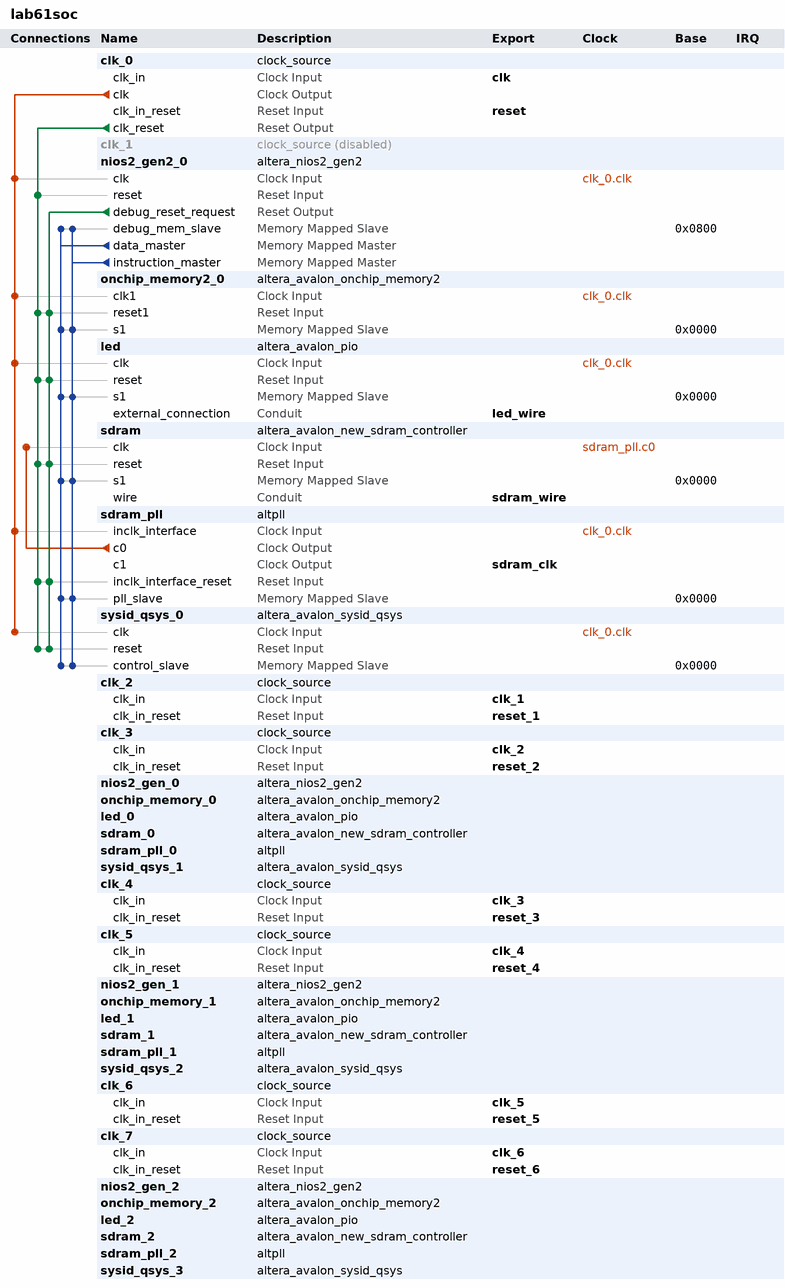
[diagram p0: system contents]
# Platform Designer (Qsys) system lab61soc, MAX 10 10M50DAF484C7G
# Parameters at their usual value, and those the tool derives, are not listed.
package require -exact qsys 18.1
create_system lab61soc
set_project_property DEVICE_FAMILY {MAX 10}
set_project_property DEVICE 10M50DAF484C7G

add_instance clk_0 clock_source 18.1
set_instance_parameter_value clk_0 clockFrequency 50000000

add_instance clk_1 clock_source 18.1
set_instance_property clk_1 ENABLED false
set_instance_parameter_value clk_1 clockFrequency 50000000

add_instance nios2_gen2_0 altera_nios2_gen2 18.1
set_instance_parameter_value nios2_gen2_0 dcache_size 2048
set_instance_parameter_value nios2_gen2_0 exceptionSlave None
set_instance_parameter_value nios2_gen2_0 icache_size 4096
set_instance_parameter_value nios2_gen2_0 impl Tiny
set_instance_parameter_value nios2_gen2_0 resetSlave None

add_instance onchip_memory2_0 altera_avalon_onchip_memory2 18.1
set_instance_parameter_value onchip_memory2_0 dataWidth 32
set_instance_parameter_value onchip_memory2_0 dualPort false
set_instance_parameter_value onchip_memory2_0 initMemContent true
set_instance_parameter_value onchip_memory2_0 initializationFileName onchip_mem.hex
set_instance_parameter_value onchip_memory2_0 memorySize 16

add_instance led altera_avalon_pio 18.1
set_instance_parameter_value led direction Output
set_instance_parameter_value led width 8

add_instance sdram altera_avalon_new_sdram_controller 18.1
set_instance_parameter_value sdram TAC 5.4
set_instance_parameter_value sdram TRCD 20.0
set_instance_parameter_value sdram TRP 20.0
set_instance_parameter_value sdram casLatency 3
set_instance_parameter_value sdram columnWidth 10
set_instance_parameter_value sdram dataWidth 16
set_instance_parameter_value sdram generateSimulationModel false
set_instance_parameter_value sdram model single_Micron_MT48LC4M32B2_7_chip
set_instance_parameter_value sdram numberOfBanks 4
set_instance_parameter_value sdram numberOfChipSelects 1
set_instance_parameter_value sdram powerUpDelay 100.0
set_instance_parameter_value sdram refreshPeriod 15.625
set_instance_parameter_value sdram rowWidth 13

add_instance sdram_pll altpll 18.1
set_instance_parameter_value sdram_pll CLK0_DIVIDE_BY 1
set_instance_parameter_value sdram_pll CLK0_MULTIPLY_BY 1
set_instance_parameter_value sdram_pll CLK1_DIVIDE_BY 1
set_instance_parameter_value sdram_pll CLK1_DUTY_CYCLE 50
set_instance_parameter_value sdram_pll CLK1_MULTIPLY_BY 1
set_instance_parameter_value sdram_pll CLK1_PHASE_SHIFT -1000
set_instance_parameter_value sdram_pll INCLK0_INPUT_FREQUENCY 20000
set_instance_parameter_value sdram_pll PORT_ARESET PORT_UNUSED
set_instance_parameter_value sdram_pll PORT_LOCKED PORT_UNUSED
set_instance_parameter_value sdram_pll PORT_clk1 PORT_USED
set_instance_parameter_value sdram_pll PORT_clk2 PORT_UNUSED
set_instance_parameter_value sdram_pll PORT_clk3 PORT_UNUSED

add_instance sysid_qsys_0 altera_avalon_sysid_qsys 18.1
set_instance_parameter_value sysid_qsys_0 id 0

add_instance clk_2 clock_source 18.1
set_instance_parameter_value clk_2 clockFrequency 50000000

add_instance clk_3 clock_source 18.1
set_instance_parameter_value clk_3 clockFrequency 50000000

add_instance nios2_gen_0 altera_nios2_gen2 18.1
set_instance_parameter_value nios2_gen_0 dcache_size 2048
set_instance_parameter_value nios2_gen_0 exceptionSlave None
set_instance_parameter_value nios2_gen_0 icache_size 4096
set_instance_parameter_value nios2_gen_0 impl Tiny
set_instance_parameter_value nios2_gen_0 resetSlave None

add_instance onchip_memory_0 altera_avalon_onchip_memory2 18.1
set_instance_parameter_value onchip_memory_0 dataWidth 32
set_instance_parameter_value onchip_memory_0 dualPort false
set_instance_parameter_value onchip_memory_0 initMemContent true
set_instance_parameter_value onchip_memory_0 initializationFileName onchip_mem.hex
set_instance_parameter_value onchip_memory_0 memorySize 16

add_instance led_0 altera_avalon_pio 18.1
set_instance_parameter_value led_0 direction Output
set_instance_parameter_value led_0 width 8

add_instance sdram_0 altera_avalon_new_sdram_controller 18.1
set_instance_parameter_value sdram_0 TAC 5.4
set_instance_parameter_value sdram_0 TRCD 20.0
set_instance_parameter_value sdram_0 TRP 20.0
set_instance_parameter_value sdram_0 casLatency 3
set_instance_parameter_value sdram_0 columnWidth 10
set_instance_parameter_value sdram_0 dataWidth 16
set_instance_parameter_value sdram_0 generateSimulationModel false
set_instance_parameter_value sdram_0 model single_Micron_MT48LC4M32B2_7_chip
set_instance_parameter_value sdram_0 numberOfBanks 4
set_instance_parameter_value sdram_0 numberOfChipSelects 1
set_instance_parameter_value sdram_0 powerUpDelay 100.0
set_instance_parameter_value sdram_0 refreshPeriod 15.625
set_instance_parameter_value sdram_0 rowWidth 13

add_instance sdram_pll_0 altpll 18.1
set_instance_parameter_value sdram_pll_0 CLK0_DIVIDE_BY 1
set_instance_parameter_value sdram_pll_0 CLK0_MULTIPLY_BY 1
set_instance_parameter_value sdram_pll_0 CLK1_DIVIDE_BY 1
set_instance_parameter_value sdram_pll_0 CLK1_DUTY_CYCLE 50
set_instance_parameter_value sdram_pll_0 CLK1_MULTIPLY_BY 1
set_instance_parameter_value sdram_pll_0 CLK1_PHASE_SHIFT -1000
set_instance_parameter_value sdram_pll_0 INCLK0_INPUT_FREQUENCY 20000
set_instance_parameter_value sdram_pll_0 PORT_ARESET PORT_UNUSED
set_instance_parameter_value sdram_pll_0 PORT_LOCKED PORT_UNUSED
set_instance_parameter_value sdram_pll_0 PORT_clk1 PORT_USED
set_instance_parameter_value sdram_pll_0 PORT_clk2 PORT_UNUSED
set_instance_parameter_value sdram_pll_0 PORT_clk3 PORT_UNUSED

add_instance sysid_qsys_1 altera_avalon_sysid_qsys 18.1
set_instance_parameter_value sysid_qsys_1 id 0

add_instance clk_4 clock_source 18.1
set_instance_parameter_value clk_4 clockFrequency 50000000

add_instance clk_5 clock_source 18.1
set_instance_parameter_value clk_5 clockFrequency 50000000

add_instance nios2_gen_1 altera_nios2_gen2 18.1
set_instance_parameter_value nios2_gen_1 dcache_size 2048
set_instance_parameter_value nios2_gen_1 exceptionSlave None
set_instance_parameter_value nios2_gen_1 icache_size 4096
set_instance_parameter_value nios2_gen_1 impl Tiny
set_instance_parameter_value nios2_gen_1 resetSlave None

add_instance onchip_memory_1 altera_avalon_onchip_memory2 18.1
set_instance_parameter_value onchip_memory_1 dataWidth 32
set_instance_parameter_value onchip_memory_1 dualPort false
set_instance_parameter_value onchip_memory_1 initMemContent true
set_instance_parameter_value onchip_memory_1 initializationFileName onchip_mem.hex
set_instance_parameter_value onchip_memory_1 memorySize 16

add_instance led_1 altera_avalon_pio 18.1
set_instance_parameter_value led_1 direction Output
set_instance_parameter_value led_1 width 8

add_instance sdram_1 altera_avalon_new_sdram_controller 18.1
set_instance_parameter_value sdram_1 TAC 5.4
set_instance_parameter_value sdram_1 TRCD 20.0
set_instance_parameter_value sdram_1 TRP 20.0
set_instance_parameter_value sdram_1 casLatency 3
set_instance_parameter_value sdram_1 columnWidth 10
set_instance_parameter_value sdram_1 dataWidth 16
set_instance_parameter_value sdram_1 generateSimulationModel false
set_instance_parameter_value sdram_1 model single_Micron_MT48LC4M32B2_7_chip
set_instance_parameter_value sdram_1 numberOfBanks 4
set_instance_parameter_value sdram_1 numberOfChipSelects 1
set_instance_parameter_value sdram_1 powerUpDelay 100.0
set_instance_parameter_value sdram_1 refreshPeriod 15.625
set_instance_parameter_value sdram_1 rowWidth 13

add_instance sdram_pll_1 altpll 18.1
set_instance_parameter_value sdram_pll_1 CLK0_DIVIDE_BY 1
set_instance_parameter_value sdram_pll_1 CLK0_MULTIPLY_BY 1
set_instance_parameter_value sdram_pll_1 CLK1_DIVIDE_BY 1
set_instance_parameter_value sdram_pll_1 CLK1_DUTY_CYCLE 50
set_instance_parameter_value sdram_pll_1 CLK1_MULTIPLY_BY 1
set_instance_parameter_value sdram_pll_1 CLK1_PHASE_SHIFT -1000
set_instance_parameter_value sdram_pll_1 INCLK0_INPUT_FREQUENCY 20000
set_instance_parameter_value sdram_pll_1 PORT_ARESET PORT_UNUSED
set_instance_parameter_value sdram_pll_1 PORT_LOCKED PORT_UNUSED
set_instance_parameter_value sdram_pll_1 PORT_clk1 PORT_USED
set_instance_parameter_value sdram_pll_1 PORT_clk2 PORT_UNUSED
set_instance_parameter_value sdram_pll_1 PORT_clk3 PORT_UNUSED

add_instance sysid_qsys_2 altera_avalon_sysid_qsys 18.1
set_instance_parameter_value sysid_qsys_2 id 0

add_instance clk_6 clock_source 18.1
set_instance_parameter_value clk_6 clockFrequency 50000000

add_instance clk_7 clock_source 18.1
set_instance_parameter_value clk_7 clockFrequency 50000000

add_instance nios2_gen_2 altera_nios2_gen2 18.1
set_instance_parameter_value nios2_gen_2 dcache_size 2048
set_instance_parameter_value nios2_gen_2 exceptionSlave None
set_instance_parameter_value nios2_gen_2 icache_size 4096
set_instance_parameter_value nios2_gen_2 impl Tiny
set_instance_parameter_value nios2_gen_2 resetSlave None

add_instance onchip_memory_2 altera_avalon_onchip_memory2 18.1
set_instance_parameter_value onchip_memory_2 dataWidth 32
set_instance_parameter_value onchip_memory_2 dualPort false
set_instance_parameter_value onchip_memory_2 initMemContent true
set_instance_parameter_value onchip_memory_2 initializationFileName onchip_mem.hex
set_instance_parameter_value onchip_memory_2 memorySize 16

add_instance led_2 altera_avalon_pio 18.1
set_instance_parameter_value led_2 direction Output
set_instance_parameter_value led_2 width 8

add_instance sdram_2 altera_avalon_new_sdram_controller 18.1
set_instance_parameter_value sdram_2 TAC 5.4
set_instance_parameter_value sdram_2 TRCD 20.0
set_instance_parameter_value sdram_2 TRP 20.0
set_instance_parameter_value sdram_2 casLatency 3
set_instance_parameter_value sdram_2 columnWidth 10
set_instance_parameter_value sdram_2 dataWidth 16
set_instance_parameter_value sdram_2 generateSimulationModel false
set_instance_parameter_value sdram_2 model single_Micron_MT48LC4M32B2_7_chip
set_instance_parameter_value sdram_2 numberOfBanks 4
set_instance_parameter_value sdram_2 numberOfChipSelects 1
set_instance_parameter_value sdram_2 powerUpDelay 100.0
set_instance_parameter_value sdram_2 refreshPeriod 15.625
set_instance_parameter_value sdram_2 rowWidth 13

add_instance sdram_pll_2 altpll 18.1
set_instance_parameter_value sdram_pll_2 CLK0_DIVIDE_BY 1
set_instance_parameter_value sdram_pll_2 CLK0_MULTIPLY_BY 1
set_instance_parameter_value sdram_pll_2 CLK1_DIVIDE_BY 1
set_instance_parameter_value sdram_pll_2 CLK1_DUTY_CYCLE 50
set_instance_parameter_value sdram_pll_2 CLK1_MULTIPLY_BY 1
set_instance_parameter_value sdram_pll_2 CLK1_PHASE_SHIFT -1000
set_instance_parameter_value sdram_pll_2 INCLK0_INPUT_FREQUENCY 20000
set_instance_parameter_value sdram_pll_2 PORT_ARESET PORT_UNUSED
set_instance_parameter_value sdram_pll_2 PORT_LOCKED PORT_UNUSED
set_instance_parameter_value sdram_pll_2 PORT_clk1 PORT_USED
set_instance_parameter_value sdram_pll_2 PORT_clk2 PORT_UNUSED
set_instance_parameter_value sdram_pll_2 PORT_clk3 PORT_UNUSED

add_instance sysid_qsys_3 altera_avalon_sysid_qsys 18.1
set_instance_parameter_value sysid_qsys_3 id 0

# connections
add_connection clk_0.clk led.clk clock
add_connection clk_0.clk nios2_gen2_0.clk clock
add_connection clk_0.clk onchip_memory2_0.clk1 clock
add_connection clk_0.clk sdram_pll.inclk_interface clock
add_connection clk_0.clk sysid_qsys_0.clk clock
add_connection sdram_pll.c0 sdram.clk clock
add_connection clk_0.clk_reset led.reset reset
add_connection clk_0.clk_reset nios2_gen2_0.reset reset
add_connection clk_0.clk_reset onchip_memory2_0.reset1 reset
add_connection clk_0.clk_reset sdram.reset reset
add_connection clk_0.clk_reset sdram_pll.inclk_interface_reset reset
add_connection clk_0.clk_reset sysid_qsys_0.reset reset
add_connection nios2_gen2_0.debug_reset_request led.reset reset
add_connection nios2_gen2_0.debug_reset_request onchip_memory2_0.reset1 reset
add_connection nios2_gen2_0.debug_reset_request sdram.reset reset
add_connection nios2_gen2_0.debug_reset_request sdram_pll.inclk_interface_reset reset
add_connection nios2_gen2_0.debug_reset_request sysid_qsys_0.reset reset
add_connection nios2_gen2_0.data_master led.s1 avalon
set_connection_parameter_value nios2_gen2_0.data_master/led.s1 baseAddress 0x0000
add_connection nios2_gen2_0.data_master nios2_gen2_0.debug_mem_slave avalon
set_connection_parameter_value nios2_gen2_0.data_master/nios2_gen2_0.debug_mem_slave baseAddress 0x0800
add_connection nios2_gen2_0.data_master onchip_memory2_0.s1 avalon
set_connection_parameter_value nios2_gen2_0.data_master/onchip_memory2_0.s1 baseAddress 0x0000
add_connection nios2_gen2_0.data_master sdram.s1 avalon
set_connection_parameter_value nios2_gen2_0.data_master/sdram.s1 baseAddress 0x0000
add_connection nios2_gen2_0.data_master sdram_pll.pll_slave avalon
set_connection_parameter_value nios2_gen2_0.data_master/sdram_pll.pll_slave baseAddress 0x0000
add_connection nios2_gen2_0.data_master sysid_qsys_0.control_slave avalon
set_connection_parameter_value nios2_gen2_0.data_master/sysid_qsys_0.control_slave baseAddress 0x0000
add_connection nios2_gen2_0.instruction_master led.s1 avalon
set_connection_parameter_value nios2_gen2_0.instruction_master/led.s1 baseAddress 0x0000
add_connection nios2_gen2_0.instruction_master nios2_gen2_0.debug_mem_slave avalon
set_connection_parameter_value nios2_gen2_0.instruction_master/nios2_gen2_0.debug_mem_slave baseAddress 0x0800
add_connection nios2_gen2_0.instruction_master onchip_memory2_0.s1 avalon
set_connection_parameter_value nios2_gen2_0.instruction_master/onchip_memory2_0.s1 baseAddress 0x0000
add_connection nios2_gen2_0.instruction_master sdram.s1 avalon
set_connection_parameter_value nios2_gen2_0.instruction_master/sdram.s1 baseAddress 0x0000
add_connection nios2_gen2_0.instruction_master sdram_pll.pll_slave avalon
set_connection_parameter_value nios2_gen2_0.instruction_master/sdram_pll.pll_slave baseAddress 0x0000
add_connection nios2_gen2_0.instruction_master sysid_qsys_0.control_slave avalon
set_connection_parameter_value nios2_gen2_0.instruction_master/sysid_qsys_0.control_slave baseAddress 0x0000

# exported interfaces
add_interface clk clock sink
set_interface_property clk EXPORT_OF clk_0.clk_in
add_interface clk_1 clock sink
set_interface_property clk_1 EXPORT_OF clk_2.clk_in
add_interface clk_2 clock sink
set_interface_property clk_2 EXPORT_OF clk_3.clk_in
add_interface clk_3 clock sink
set_interface_property clk_3 EXPORT_OF clk_4.clk_in
add_interface clk_4 clock sink
set_interface_property clk_4 EXPORT_OF clk_5.clk_in
add_interface clk_5 clock sink
set_interface_property clk_5 EXPORT_OF clk_6.clk_in
add_interface clk_6 clock sink
set_interface_property clk_6 EXPORT_OF clk_7.clk_in
add_interface led_wire conduit end
set_interface_property led_wire EXPORT_OF led.external_connection
add_interface reset reset sink
set_interface_property reset EXPORT_OF clk_0.clk_in_reset
add_interface reset_1 reset sink
set_interface_property reset_1 EXPORT_OF clk_2.clk_in_reset
add_interface reset_2 reset sink
set_interface_property reset_2 EXPORT_OF clk_3.clk_in_reset
add_interface reset_3 reset sink
set_interface_property reset_3 EXPORT_OF clk_4.clk_in_reset
add_interface reset_4 reset sink
set_interface_property reset_4 EXPORT_OF clk_5.clk_in_reset
add_interface reset_5 reset sink
set_interface_property reset_5 EXPORT_OF clk_6.clk_in_reset
add_interface reset_6 reset sink
set_interface_property reset_6 EXPORT_OF clk_7.clk_in_reset
add_interface sdram_clk clock source
set_interface_property sdram_clk EXPORT_OF sdram_pll.c1
add_interface sdram_wire conduit end
set_interface_property sdram_wire EXPORT_OF sdram.wire

set_interconnect_requirement {$system} qsys_mm.clockCrossingAdapter HANDSHAKE
set_interconnect_requirement {$system} qsys_mm.enableEccProtection FALSE
set_interconnect_requirement {$system} qsys_mm.insertDefaultSlave FALSE
set_interconnect_requirement {$system} qsys_mm.maxAdditionalLatency 1

save_system lab61soc.qsys
